# EAGLE design Gun (EAGLE 9.6.2)
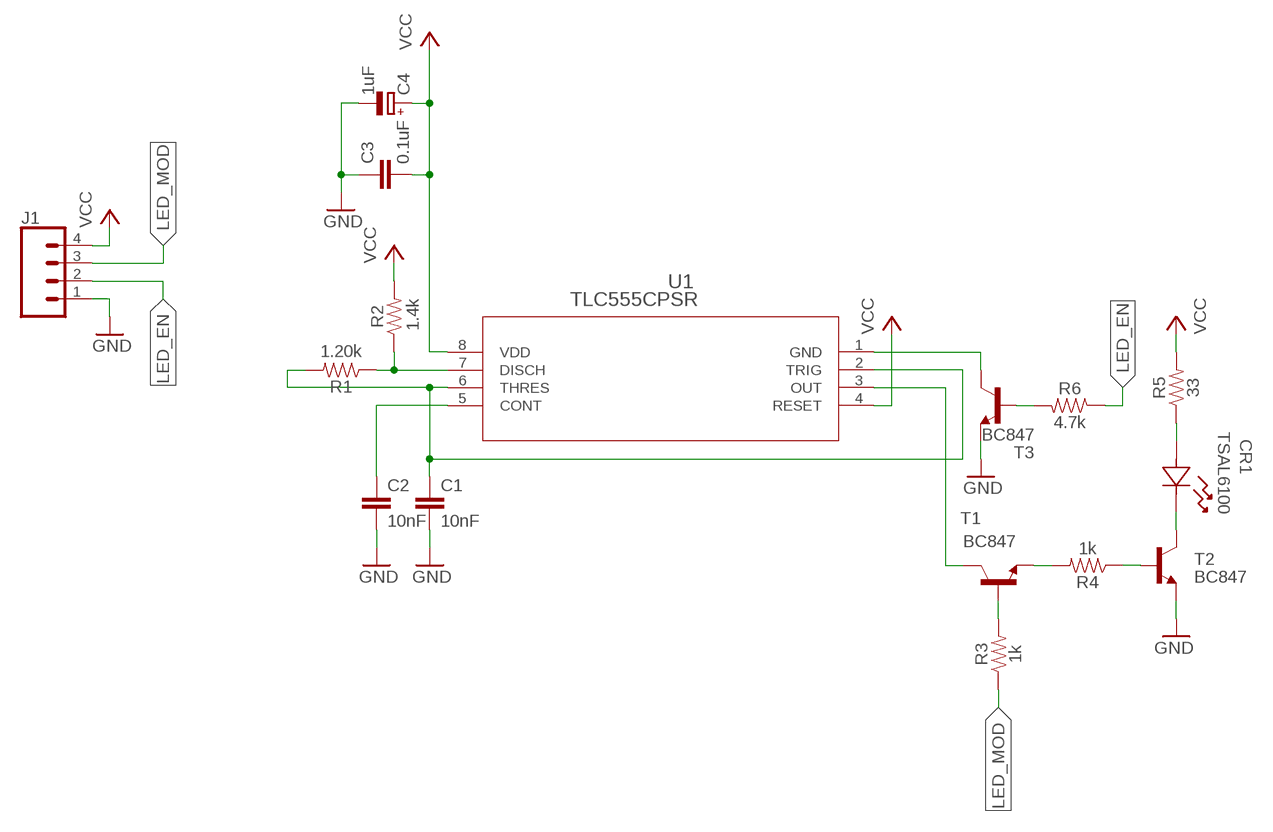
[diagram p0: schematic, sheet 1]

## Parts
C1  10nF  10NF-0603-50V-10%  [0603]
C2  10nF  10NF-0603-50V-10%  [0603]
C3  0.1uF  10NF-0603-50V-10%  [0603]
C4  1uF  CPOL-EUE2.5-5  [E2,5-5]
CR1  TSAL6100  [LED_TLH]
J1  CONN_04POLAR  [MOLEX-1X4]
R1  1.20k  1.20KOHM-0603-1/10W-1%  [0603]
R2  1.4k  RESISTOR0603  [0603]
R3  1k  1KOHM-0603-1/10W-1%  [0603]
R4  1k  1KOHM-0603-1/10W-1%  [0603]
R5  33  33OHM-0603-1/10W-1%  [0603]
R6  4.7k  4.7KOHM-0603-1/10W-1%  [0603]
T1  BC847  [SOT23]
T2  BC847  [SOT23]
T3  BC847  [SOT23]
U1  TLC555CPSR  [PS8]

## Nets
GND: C1.2 C2.2 C3.1 C4.- J1.1 T2.2(E) T3.2(E)
LED_EN: J1.2 R6.1
LED_MOD: J1.3 R3.1
N$1: T3.3(C) U1.1(GND)
N$2: R6.2 T3.1(B)
N$3: T1.3(C) U1.3(OUT)
N$4: R4.2 T1.2(E)
N$5: CR1.1 T2.3(C)
N$6: C1.1 R1.2 U1.2(TRIG) U1.6(THRES)
N$7: CR1.2 R5.1
N$8: R4.1 T2.1(B)
N$9: R3.2 T1.1(B)
N$10: R1.1 R2.1 U1.7(DISCH)
N$11: C2.1 U1.5(CONT)
VCC: C3.2 C4.+ J1.4 R2.2 R5.2 U1.4(RESET) U1.8(VDD)

## Library data of the parts
C1 C2 = SparkFun-Capacitors:10NF: 0.01uF/10nF/10,000pF ceramic capacitors A capacitor is a passive two-terminal electrical component used to store electrical energy temporarily in an electric field. CAP-09321; PROD_ID: CAP-00867
C3 = SparkFun-Capacitors:10NF: 0.01uF/10nF/10,000pF ceramic capacitors A capacitor is a passive two-terminal electrical component used to store electrical energy temporarily in an electric field. CAP-09321; PROD_ID: CAP-00867; VALUE: 10nF
C4 = rcl:CPOL-EU: POLARIZED CAPACITOR, European symbol; SPICEPREFIX: C
CR1 = TSAL6100:TSAL6100; COPYRIGHT: Copyright (C) 2022 Ultra Librarian. All rights reserved.; MANUFACTURER_PART_NUMBER: TSAL6100; MFR_NAME: Vishay
J1 = SparkFun-Connectors:CONN_04: Multi connection point. Often used as Generic Header-pin footprint for 0.1 inch spaced/style header connections On any of the 0.1 inch spaced packages, you can populate with these: Break Away Headers - Straight <https://www.sparkfun.com/products/116> (PRT-00116) Break Away Male Headers - Right Angle <https://www.sparkfun.com/products/553> (PRT-00553) Female Headers <https://www.sparkfun.com/products/115> (PRT-00115) Break Away Headers - Machine Pin <https://www.sparkfun.com/products/117> (PRT-00117) Break Away Female Headers - Swiss Machine Pin <https://www.sparkfun.com/products/743> (PRT-00743) For SCREWTERMINALS and SPRING TERMINALS visit here: Screw Terimnals on SparkFun.com <https://www.sparkfun.com/search/results?term=Screw+Terminals> (5mm/3.5mm/2.54mm spacing) This device is also useful as a general connection point to wire up your design to another part of your project. Our various solder wires solder well into these plated through hole pads. Hook-Up Wire - Assortment (Stranded, 22 AWG) <https://www.sparkfun.com/products/11375> (PRT-11375) Hook-Up Wire - Assortment (Solid Core, 22 AWG) <https://www.sparkfun.com/products/11367> (PRT-11367) View the entire wire category on our website here <https://www.sparkfun.com/categories/141> Special notes: Molex polarized connector foot print use with SKU : PRT-08231 with associated crimp pins and housings. 1MM SMD Version SKU: PRT-10208; PROD_ID: CONN-08186; SF_ID: PRT-08231
R1 = SparkFun-Resistors:1.20KOHM: 1.20kΩ resistor A resistor is a passive two-terminal electrical component that implements electrical resistance as a circuit element. Resistors act to reduce current flow, and, at the same time, act to lower voltage levels within circuits. - Wikipedia; PROD_ID: RES-08413
R2 = SparkFun-Resistors:RESISTOR: Generic Resistor Package
R3 R4 = SparkFun-Resistors:1KOHM: 1kΩ resistor A resistor is a passive two-terminal electrical component that implements electrical resistance as a circuit element. Resistors act to reduce current flow, and, at the same time, act to lower voltage levels within circuits. - Wikipedia; PROD_ID: RES-07856
R5 = SparkFun-Resistors:33OHM: 33Ω resistor A resistor is a passive two-terminal electrical component that implements electrical resistance as a circuit element. Resistors act to reduce current flow, and, at the same time, act to lower voltage levels within circuits. - Wikipedia; PROD_ID: RES-08270
R6 = SparkFun-Resistors:4.7KOHM: 4.7kΩ resistor A resistor is a passive two-terminal electrical component that implements electrical resistance as a circuit element. Resistors act to reduce current flow, and, at the same time, act to lower voltage levels within circuits. - Wikipedia; PROD_ID: RES-07857
T1-T3 = transistor:BC847: NPN TRANSISTOR
U1 = TLC555CPSR:TLC555CPSR; COPYRIGHT: Copyright (C) 2022 Ultra Librarian. All rights reserved.; DIGI-KEY_PART_NUMBER_1: 296-15028-1-ND; DIGI-KEY_PART_NUMBER_2: 296-15028-2-ND; DIGI-KEY_PART_NUMBER_3: 296-15028-6-ND; DIGI-KEY_PART_NUMBER_4: 2156-TLC555CPSR-ND; MANUFACTURER_PART_NUMBER: TLC555CPSR; MFR_NAME: Texas Instruments

## Board
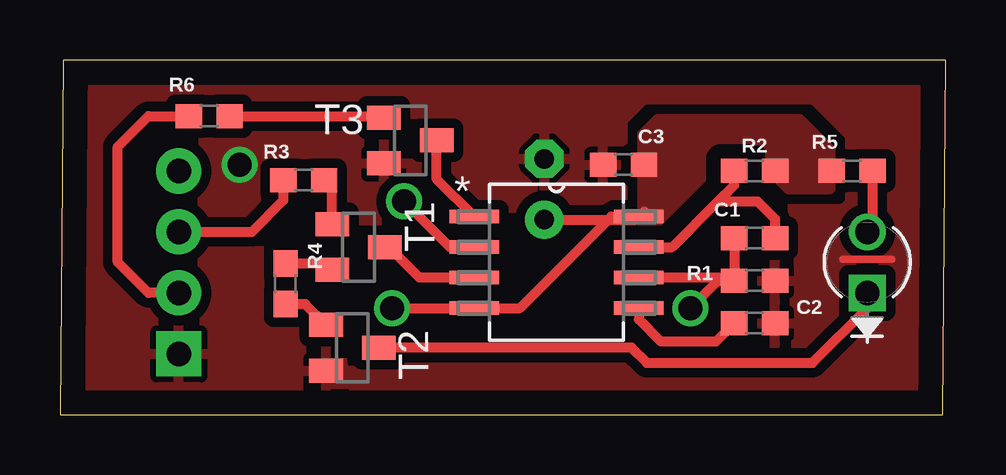
[diagram p1: board, top side]
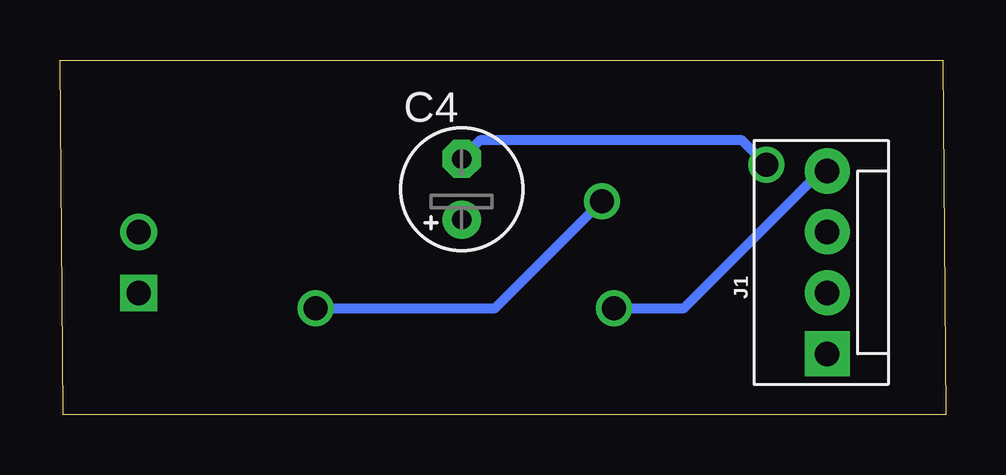
[diagram p2: board, bottom side, seen from below]

Size 36.94 x 14.78 mm. Coordinates in mm from the lower left corner, seen from the top.
Outline: 0,0 36.81,0 36.94,14.78 0.13,14.78 0,0
Copper layers (1*16): Top 0.035mm / dielectric 1.5mm / Bottom 0.035mm
Design rules "default": minimum track width 6mil, minimum drill 0.35mm, track to track 6mil, track to pad 6mil, pad to pad 6mil, via to via 6mil, smd to smd 6mil, copper to edge 40mil, drill to drill 6mil, minimum pad ring 10mil, minimum via ring 8mil, stop-mask expansion 4mil, vias tented up to drill 0mil, thermal gap 10mil

### Footprints (pad centres in the part's own frame; a part is rotated, then mirrored left to right if it is on the bottom)
0603 = smd 1.1 x 1: 1 -0.85,0; 2 0.85,0
E2,5-5 = drill 0.813 pad 1.6: + -1.27,0 | drill 0.813 pad 1.6 octagon: - 1.27,0
LED_TLH = drill 1.016 pad 1.524 square: 1 -2.54,0 | drill 1.016 pad 1.524: 2 0,0
MOLEX-1X4 = drill 1.016 pad 1.88 square: 1 0,0 | drill 1.016 pad 1.88: 2 2.54,0; 3 5.08,0; 4 7.62,0
SOT23 = smd 1 x 1.4: 1 -0.95,-1.1; 2 0.95,-1.1; 3 0,1.1
PS8 = smd 2.057 x 0.559: 1 -3.429,1.905; 2 -3.429,0.635; 3 -3.429,-0.635; 4 -3.429,-1.905; 5 3.429,-1.905; 6 3.429,-0.635; 7 3.429,0.635; 8 3.429,1.905

### Placement (x,y rotation side)
C1  28.96,5.59 0 top
C2  28.96,3.81 0 top
C3  23.5,10.41 0 top
C4  20.19,9.4 90 bottom
CR1  33.66,7.62 90 top
J1  4.95,2.54 90 bottom
R1  28.96,7.37 180 top
R2  28.96,10.16 0 top
R3  10.16,9.78 0 top
R4  9.4,5.46 90 top
R5  33.02,10.16 180 top
R6  6.22,12.45 0 top
T1  12.45,6.99 270 top
T2  12.19,2.79 270 top
T3  14.61,11.43 270 top
U1  20.7,6.35 0 top

### Tracks (layer width: path | path; a pad name or v marks a point on that pad's centre or on a via)
GND  (via drill 1 pad 1.3)
  Top 0.305: 32.64,6.48 34.67,6.48
  Bottom 0.406: v7.49,10.41 8.51,11.43 19.43,11.43 C4.-
  pour Top (isolate 0.406, rank 6): 0,13.59 0,0 36.83,0 36.83,13.59
  pour Top (isolate 0.61, no thermals): 12.7,1.27 11.3,1.27 11.3,2.16 12.7,2.16
LED_EN
  Top 0.406: J1.2 3.68,5.08 2.41,6.35 2.41,11.18 3.68,12.45 R6.1
LED_MOD
  Top 0.406: J1.3 8,7.62 9.31,8.93 R3.1
N$1
  Top 0.406: U1.1 15.71,9.82 T3.3
N$2
  Top 0.406: T3.1 13.44,12.45 R6.2
N$3
  Top 0.406: U1.3 14.99,5.71 13.72,6.99 T1.3
N$4
  Top 0.406: R4.2 9.42,6.29 11.09,6.29 T1.2
N$5
  Top 0.406: CR1.1 33.66,4.45 31.37,2.16 24.47,2.16 23.83,2.79 T2.3
N$6  (via drill 1 pad 1.3)
  Top 0.406: R1.2 C1.1 | U1.6 27.98,5.71 C1.1 | U1.2 16.26,6.99 v14.35,8.89 | v26.29,4.45 27.43,5.59 C1.1
  Bottom 0.406: v26.29,4.45 18.8,4.45 v14.35,8.89
N$7
  Top 0.406: R5.1 33.87,7.83 CR1.2
N$8
  Top 0.406: T2.1 10.22,4.61 R4.1
N$9
  Top 0.406: T1.1 11.35,9.44 R3.2
N$10
  Top 0.406: U1.7 25.53,6.99 27.43,8.89 | R2.1 28.11,9.56 27.43,8.89 | R1.1 29.81,8.17 29.08,8.89 27.43,8.89
N$11
  Top 0.406: U1.5 24.13,3.98 25.06,3.05 27.34,3.05 C2.1
VCC  (via drill 1 pad 1.3)
  Top 0.406: 24.34,8.47 U1.8 | 29.81,10.38 R2.2 | U1.8 22.99,8.26 19.18,4.45 U1.4 v13.84,4.45 | C4.+ 24,8.13 U1.8
  Bottom 0.406: v13.84,4.45 10.92,4.45 5.21,10.16 J1.4
  pour Top (isolate 0.61, no thermals): 24.89,12.32 24.26,11.68 24.26,7.37 26.8,9.91 26.8,10.79 27.43,11.43 29.34,11.43 29.59,11.18 29.59,10.16 30.35,9.4 32.13,9.4 32.13,11.05 30.86,12.32